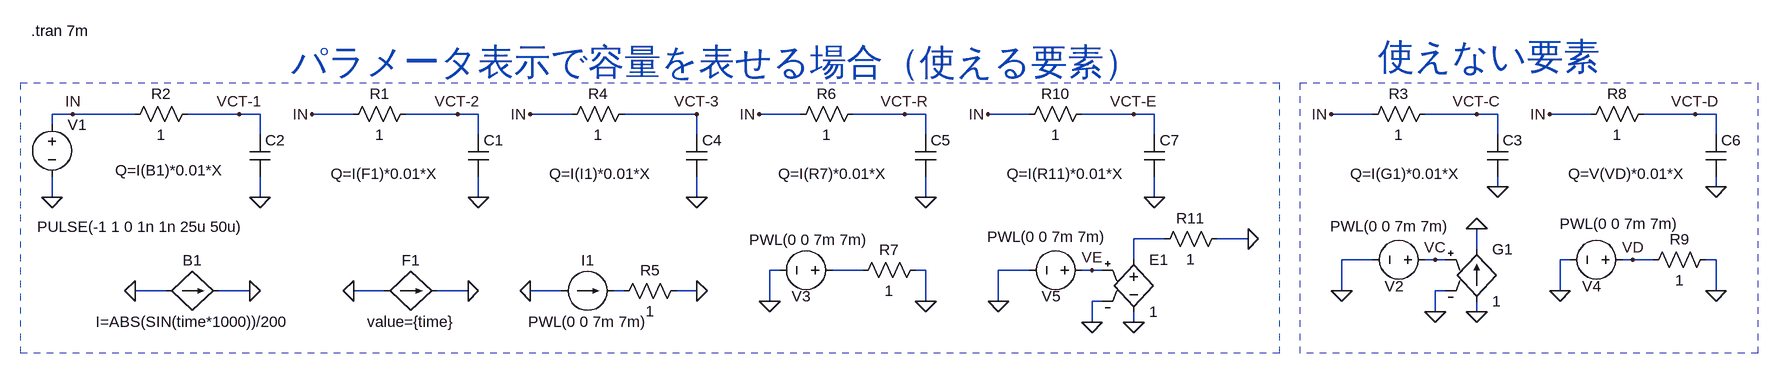
[diagram p0: schematic Fig_2-92_CAP-CONTROL-TEST.asc]
Fig_2-92_CAP-CONTROL-TEST.asc, the LTspice schematic file:
Version 4
SHEET 1 2472 1240
WIRE -144 272 -176 272
WIRE -48 272 -144 272
WIRE 112 272 32 272
WIRE 144 272 112 272
WIRE 288 272 224 272
WIRE 448 272 368 272
WIRE 480 272 448 272
WIRE 624 272 560 272
WIRE 816 272 704 272
WIRE 976 272 912 272
WIRE 1136 272 1056 272
WIRE 1168 272 1136 272
WIRE 1328 272 1264 272
WIRE 1488 272 1408 272
WIRE 1520 272 1488 272
WIRE 1856 272 1792 272
WIRE 2016 272 1936 272
WIRE 2048 272 2016 272
WIRE 2192 272 2128 272
WIRE 2352 272 2272 272
WIRE 2384 272 2352 272
WIRE -176 288 -176 272
WIRE 144 304 144 272
WIRE 480 304 480 272
WIRE 816 304 816 272
WIRE 1168 304 1168 272
WIRE 1520 304 1520 272
WIRE 2048 304 2048 272
WIRE 2384 304 2384 272
WIRE 2048 384 2048 368
WIRE 2384 384 2384 368
WIRE -176 400 -176 368
WIRE 144 400 144 368
WIRE 480 400 480 368
WIRE 816 400 816 368
WIRE 1168 400 1168 368
WIRE 1520 400 1520 368
WIRE 1536 464 1488 464
WIRE 1664 464 1616 464
WIRE 2016 480 2016 448
WIRE 1488 496 1488 464
WIRE 1856 496 1808 496
WIRE 1952 496 1936 496
WIRE 1968 496 1952 496
WIRE 2160 496 2144 496
WIRE 2256 496 2240 496
WIRE 2288 496 2256 496
WIRE 2384 496 2368 496
WIRE 944 512 928 512
WIRE 1072 512 1024 512
WIRE 1168 512 1152 512
WIRE 1328 512 1280 512
WIRE 1424 512 1408 512
WIRE 1440 512 1424 512
WIRE 0 544 -48 544
WIRE 128 544 80 544
WIRE 336 544 288 544
WIRE 464 544 416 544
WIRE 608 544 560 544
WIRE 704 544 688 544
WIRE 816 544 784 544
WIRE 1808 544 1808 496
WIRE 1968 544 1952 544
WIRE 2144 544 2144 496
WIRE 2384 544 2384 496
WIRE 928 560 928 512
WIRE 1168 560 1168 512
WIRE 1280 560 1280 512
WIRE 1440 560 1424 560
WIRE 1952 576 1952 544
WIRE 2016 576 2016 560
WIRE 1424 592 1424 560
WIRE 1488 592 1488 576
FLAG 144 400 0
FLAG -176 400 0
FLAG 112 272 VCT-1
FLAG -144 272 IN
FLAG -48 544 0
FLAG 128 544 0
FLAG 288 544 0
FLAG 464 544 0
FLAG 480 400 0
FLAG 448 272 VCT-2
FLAG 224 272 IN
FLAG 1952 576 0
FLAG 2016 576 0
FLAG 2048 384 0
FLAG 816 272 VCT-3
FLAG 1792 272 IN
FLAG 2016 448 0
FLAG 1808 544 0
FLAG 560 544 0
FLAG 816 544 0
FLAG 816 400 0
FLAG 2016 272 VCT-C
FLAG 560 272 IN
FLAG 1168 400 0
FLAG 912 272 IN
FLAG 928 560 0
FLAG 1136 272 VCT-R
FLAG 1168 560 0
FLAG 1952 496 VC
FLAG 2384 384 0
FLAG 2128 272 IN
FLAG 2352 272 VCT-D
FLAG 2144 544 0
FLAG 2384 544 0
FLAG 2256 496 VD
FLAG 1424 592 0
FLAG 1488 592 0
FLAG 1520 400 0
FLAG 1264 272 IN
FLAG 1664 464 0
FLAG 1280 560 0
FLAG 1488 272 VCT-E
FLAG 1424 512 VE
SYMBOL voltage -176 272 R0
WINDOW 3 -23 173 Left 2
WINDOW 123 0 0 Left 2
WINDOW 39 0 0 Left 2
SYMATTR Value PULSE(-1 1 0 1n 1n 25u 50u)
SYMATTR InstName V1
SYMBOL res -64 288 R270
WINDOW 0 32 56 VTop 2
WINDOW 3 0 56 VBottom 2
SYMATTR InstName R2
SYMATTR Value 1
SYMBOL cap 128 304 R0
WINDOW 3 -207 54 Left 2
SYMATTR Value Q=I(B1)*0.01*X
SYMATTR InstName C2
SYMBOL bi 0 544 R270
WINDOW 0 32 40 VTop 2
WINDOW 3 -32 40 VBottom 2
SYMATTR InstName B1
SYMATTR Value I=ABS(SIN(time*1000))/200
SYMBOL f 336 544 R270
WINDOW 0 32 40 VTop 2
WINDOW 3 -32 40 VBottom 2
SYMATTR InstName F1
SYMATTR Value value={time}
SYMBOL res 272 288 R270
WINDOW 0 32 56 VTop 2
WINDOW 3 0 56 VBottom 2
SYMATTR InstName R1
SYMATTR Value 1
SYMBOL cap 464 304 R0
WINDOW 3 -211 60 Left 2
SYMATTR Value Q=I(F1)*0.01*X
SYMATTR InstName C1
SYMBOL res 1840 288 R270
WINDOW 0 32 56 VTop 2
WINDOW 3 0 56 VBottom 2
SYMATTR InstName R3
SYMATTR Value 1
SYMBOL cap 2032 304 R0
WINDOW 3 -211 60 Left 2
SYMATTR Value Q=I(G1)*0.01*X
SYMATTR InstName C3
SYMBOL g 2016 464 R0
SYMATTR InstName G1
SYMATTR Value 1
SYMBOL voltage 1952 496 R90
WINDOW 0 56 63 VBottom 2
WINDOW 3 -67 70 VTop 2
WINDOW 123 0 0 Left 0
WINDOW 39 0 0 Left 0
SYMATTR InstName V2
SYMATTR Value PWL(0 0 7m 7m)
SYMBOL res 608 288 R270
WINDOW 0 32 56 VTop 2
WINDOW 3 0 56 VBottom 2
SYMATTR InstName R4
SYMATTR Value 1
SYMBOL cap 800 304 R0
WINDOW 3 -211 60 Left 2
SYMATTR Value Q=I(I1)*0.01*X
SYMATTR InstName C4
SYMBOL current 608 544 R270
WINDOW 0 32 40 VTop 2
WINDOW 3 -32 40 VBottom 2
WINDOW 123 0 0 Left 0
WINDOW 39 0 0 Left 0
SYMATTR InstName I1
SYMATTR Value PWL(0 0 7m 7m)
SYMBOL res 688 560 R270
WINDOW 0 32 56 VTop 2
WINDOW 3 0 56 VBottom 2
SYMATTR InstName R5
SYMATTR Value 1
SYMBOL res 960 288 R270
WINDOW 0 32 56 VTop 2
WINDOW 3 0 56 VBottom 2
SYMATTR InstName R6
SYMATTR Value 1
SYMBOL cap 1152 304 R0
WINDOW 3 -211 60 Left 2
SYMATTR Value Q=I(R7)*0.01*X
SYMATTR InstName C5
SYMBOL voltage 1040 512 R90
WINDOW 0 56 63 VBottom 2
WINDOW 3 -62 52 VTop 2
WINDOW 123 0 0 Left 0
WINDOW 39 0 0 Left 0
SYMATTR InstName V3
SYMATTR Value PWL(0 0 7m 7m)
SYMBOL res 1056 528 R270
WINDOW 0 32 56 VTop 2
WINDOW 3 0 56 VBottom 2
SYMATTR InstName R7
SYMATTR Value 1
SYMBOL res 2176 288 R270
WINDOW 0 32 56 VTop 2
WINDOW 3 0 56 VBottom 2
SYMATTR InstName R8
SYMATTR Value 1
SYMBOL cap 2368 304 R0
WINDOW 3 -211 60 Left 2
SYMATTR Value Q=V(VD)*0.01*X
SYMATTR InstName C6
SYMBOL voltage 2256 496 R90
WINDOW 0 56 63 VBottom 2
WINDOW 3 -71 21 VTop 2
WINDOW 123 0 0 Left 0
WINDOW 39 0 0 Left 0
SYMATTR InstName V4
SYMATTR Value PWL(0 0 7m 7m)
SYMBOL res 2272 512 R270
WINDOW 0 32 56 VTop 2
WINDOW 3 0 56 VBottom 2
SYMATTR InstName R9
SYMATTR Value 1
SYMBOL res 1312 288 R270
WINDOW 0 32 56 VTop 2
WINDOW 3 0 56 VBottom 2
SYMATTR InstName R10
SYMATTR Value 1
SYMBOL cap 1504 304 R0
WINDOW 3 -211 60 Left 2
SYMATTR Value Q=I(R11)*0.01*X
SYMATTR InstName C7
SYMBOL voltage 1424 512 R90
WINDOW 0 56 63 VBottom 2
WINDOW 3 -67 70 VTop 2
WINDOW 123 0 0 Left 0
WINDOW 39 0 0 Left 0
SYMATTR InstName V5
SYMATTR Value PWL(0 0 7m 7m)
SYMBOL e 1488 480 R0
SYMATTR InstName E1
SYMATTR Value 1
SYMBOL res 1520 480 R270
WINDOW 0 32 56 VTop 2
WINDOW 3 0 56 VBottom 2
SYMATTR InstName R11
SYMATTR Value 1
TEXT -208 144 Left 2 !.tran 7m
TEXT 192 192 Left 5 ;パラメータ表示で容量を表せる場合（使える要素）
TEXT 1864 184 Left 5 ;使えない要素
RECTANGLE Normal 1712 640 -224 224 2
RECTANGLE Normal 2448 640 1744 224 2

The netlist it stands for:
* Fig_2-92_CAP-CONTROL-TEST.asc
V1 IN 0 PULSE(-1 1 0 1n 1n 25u 50u)
R2 IN VCT-1 1
C2 VCT-1 0 Q=I(B1)*0.01*X
B1 0 0 I=ABS(SIN(time*1000))/200
F1 0 0 value={time}
R1 IN VCT-2 1
C1 VCT-2 0 Q=I(F1)*0.01*X
R3 IN VCT-C 1
C3 VCT-C 0 Q=I(G1)*0.01*X
G1 0 0 VC 0 1
V2 VC 0 PWL(0 0 7m 7m)
R4 IN VCT-3 1
C4 VCT-3 0 Q=I(I1)*0.01*X
I1 0 N003 PWL(0 0 7m 7m)
R5 N003 0 1
R6 IN VCT-R 1
C5 VCT-R 0 Q=I(R7)*0.01*X
V3 N002 0 PWL(0 0 7m 7m)
R7 N002 0 1
R8 IN VCT-D 1
C6 VCT-D 0 Q=V(VD)*0.01*X
V4 VD 0 PWL(0 0 7m 7m)
R9 VD 0 1
R10 IN VCT-E 1
C7 VCT-E 0 Q=I(R11)*0.01*X
V5 VE 0 PWL(0 0 7m 7m)
E1 N001 0 VE 0 1
R11 N001 0 1
.tran 7m
* パラメータ表示で容量を表せる場合（使える要素）
* 使えない要素
.backanno
.end